# EAGLE design gpi-filter (EAGLE 7.1.0)
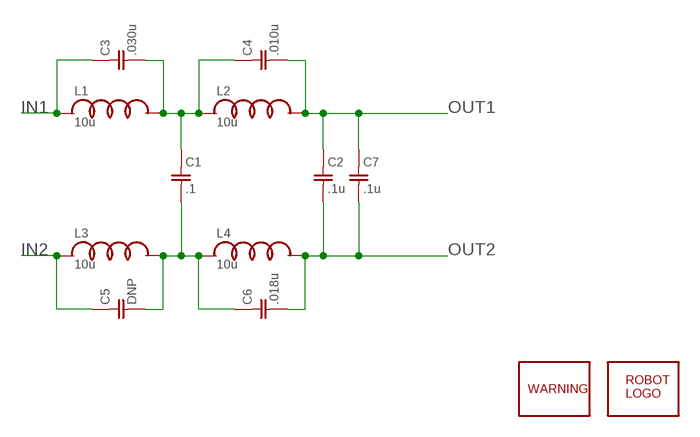
[diagram p0: schematic, sheet 1]

## Parts
C1  .1  C1210  [SMD1210]
C2  .1u  C1210  [SMD1210]
C3  .030u  C1210  [SMD1210]
C4  .010u  C1210  [SMD1210]
C5  DNP  C1210  [SMD1210]
C6  .018u  C1210  [SMD1210]
C7  .1u  C1210  [SMD1210]
L1  10u  LXAL10  [XAL10]
L2  10u  LXAL10  [XAL10]
L3  10u  LXAL10  [XAL10]
L4  10u  LXAL10  [XAL10]
U$1  ROBOTMAN-LOGO  [ROBOTMAN-LOGO]
U$2  SYMBOL-WARNING  [SYMBOL-WARNING]

## Nets
IN1: C3.1 L1.P$1
IN2: C5.1 L3.P$1
N$1: C1.1 C3.2 C4.1 L1.P$2 L2.P$1
N$4: C1.2 C5.2 C6.1 L3.P$2 L4.P$1
OUT1: C2.1 C4.2 C7.1 L2.P$2
OUT2: C2.2 C6.2 C7.2 L4.P$2

## Library data of the parts
C1-C7 = jaw:C
L1-L4 = jaw:L
U$1 = jaw:ROBOTMAN-LOGO
U$2 = jaw:SYMBOL-WARNING

## Board
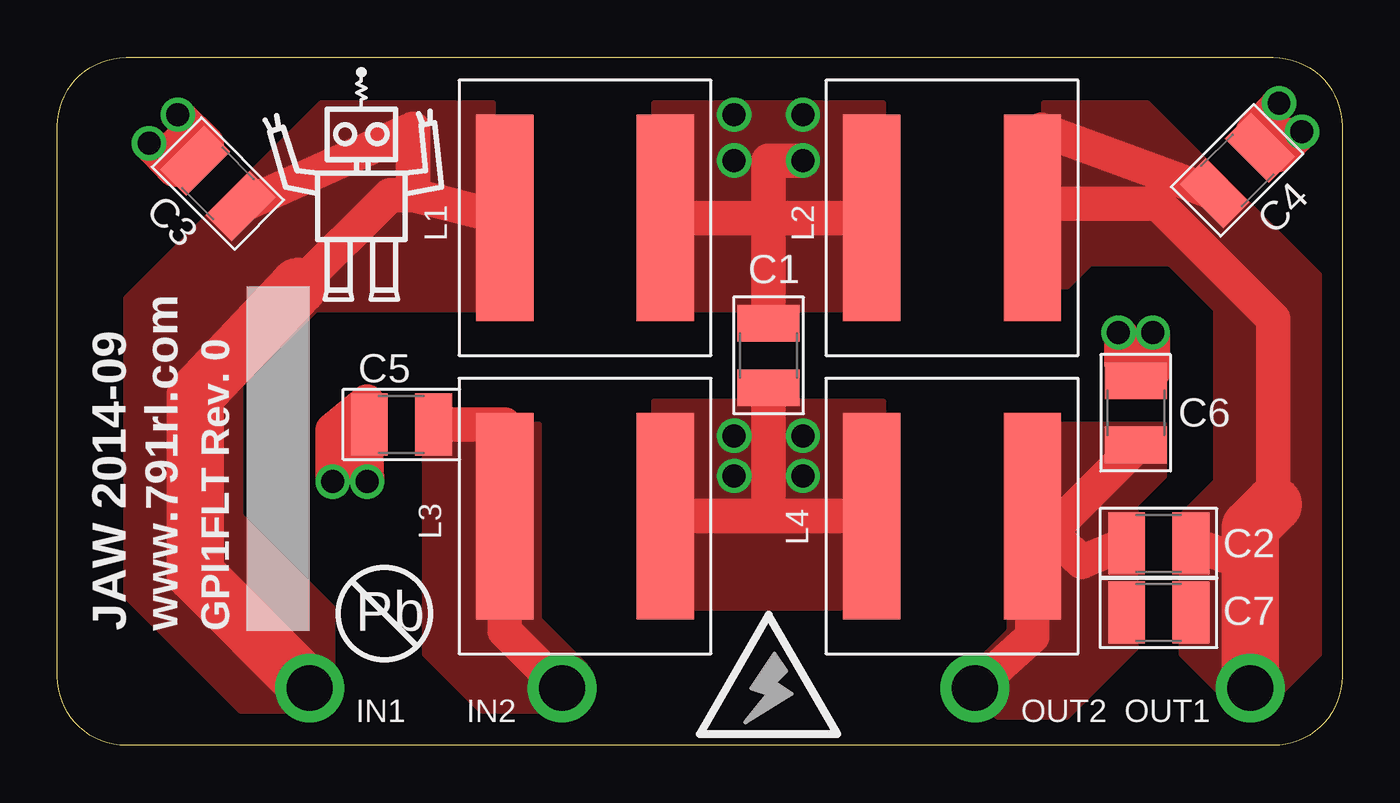
[diagram p1: board, top side]
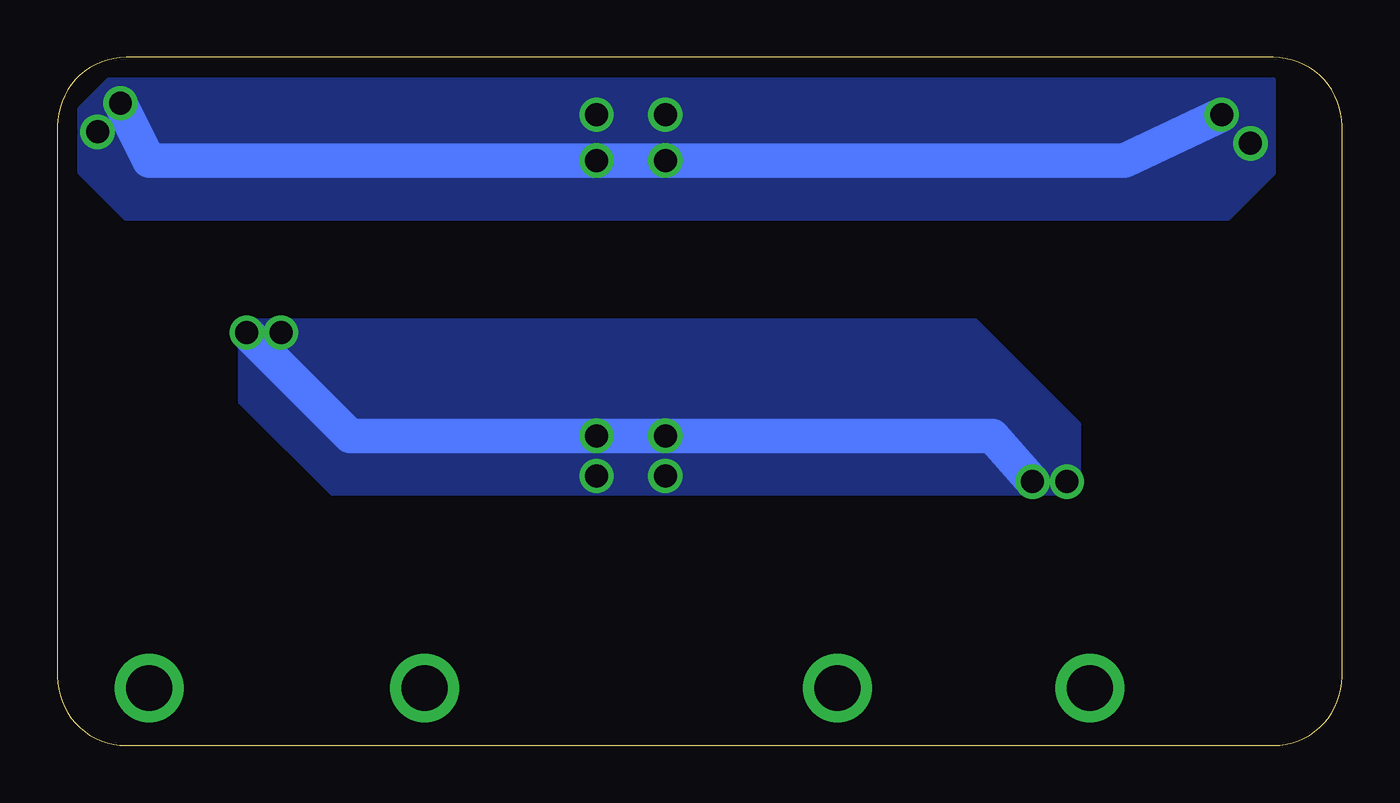
[diagram p2: board, bottom side, seen from below]

Size 56 x 30 mm. Coordinates in mm from the lower left corner, seen from the top.
Outline: 3,30 53,30 arc-90 56,27 56,3 arc-90 53,0 3,0 arc-90 0,3 0,27 arc-90 3,30
Copper layers (1*16): Top 0.0356mm / dielectric 1.5011mm / Bottom 0.0356mm
Design rules "LaenPCBOrder *": minimum track width 6mil, minimum drill 13mil, track to track 6mil, track to pad 6mil, pad to pad 6mil, via to via 6mil, smd to smd 6mil, copper to edge 15mil, drill to drill 6mil, minimum pad ring 7mil, minimum via ring 7mil, stop-mask expansion 4mil, vias tented up to drill 1.5mm, thermal gap 10mil

### Footprints (pad centres in the part's own frame; a part is rotated, then mirrored left to right if it is on the bottom)
SMD1210 = smd 1.6 x 2.7: 1 -1.4,0; 2 1.4,0
XAL10 = smd 2.5 x 9: P$1 -3.5,0; P$2 3.5,0

### Placement (x,y rotation side)
C1  31,17 270 top
C2  48,8.8 180 top
C3  .027u  [SMD1210]  7,24.5 135 top
C4  .018u  [SMD1210]  51.43,25.07 225 top
C5  15,14 180 top
C6  .010u  [SMD1210]  47,14.5 270 top
C7  48,5.8 180 top
L1  23,23 0 top
L2  39,23 0 top
L3  23,10 0 top
L4  39,10 0 top
U$1  13.25,23.75 0 top
U$2  31,2.5 0 top

### Tracks (layer width: path | path; a pad name or v marks a point on that pad's centre or on a via)
IN1  (via drill 2 pad 3)
  Top 1.5: 10.5,20 14.5,24 15.5,24 | 15.5,24 L1.P$1 | C3.1 15.5,26.9 15.5,24
  Top 2.5: 10.5,20 6,15.25 6,7.5 v11,2.5
  pour Top (no thermals): 12,1.5 12,6 8,10 8,15.75 11.25,19 19,19 19,28 11.5,28 3,19.5 3,6.5 8,1.5
IN2  (via drill 2 pad 3)
  Top 1.5: v22,2.5 19.5,5 L3.P$1 19.5,14 C5.1
  pour Top (no thermals): 21,14 21,5.5 23,3.5 21,1.5 18.5,1.5 16,4 16,13 17,14
N$1  (via drill 1)
  Top 1.5: L1.P$2 31,23 | 31,23 L2.P$1 | C1.1 31,23 | v32.5,25.5 31,25.5 31,23 | v53.25,28 52.1,26.75 C4.1 53.65,26.6 52.5,26.25 53.25,25.75 v54.25,26.75 | v4,26.25 5.1,25.1 | 5.1,25.1 5.25,26.25 | 5.25,26.25 5.1,25.1 | 5.1,25.1 C3.2 6,25.98 5.25,26.25 | v5.25,27.5 6.5,26.25 5.25,26.25
  Bottom 1.5: v5.25,27.5 9.5,25.5 v32.5,25.5 52,25.5 v53.25,28
  other vias: 29.5,27.5 32.5,27.5 29.5,25.5
  pour Top (no thermals): 26,28 36,28 36,19 26,19
  pour Bottom (no thermals): 3,29 53.75,29 55,27.75 55,25 53,23 5,23 3,25
N$4  (via drill 1)
  Top 1.5: L3.P$2 29.75,10 31,10 | 31,10 L4.P$1 | v13.5,11.5 13.4,14.5 C5.2 13.6,13.85 13.5,15 12,13.75 v12,11.5 | C1.2 31,10 | v46.25,18 46.38,17.88 46.38,16.62 46.6,16.4 C6.1 | v47.75,18 47.75,16.25 47.5,16 47,16
  Bottom 1.5: v47.75,18 43.25,13.5 v32.5,13.5 15.25,13.5 v13.5,11.5
  other vias: 29.5,13.5 29.5,11.75 32.5,11.75
  pour Top (no thermals): 26,15 36,15 36,6 26,6
  pour Bottom (no thermals): 48,18.5 16,18.5 11.5,14 11.5,11.5 12,11 44,11 48,15
OUT1  (via drill 2 pad 3)
  Top 1.5: C2.1 51.9,7.9 52,9.5 | L2.P$2 42.88,23.62 | 42.88,23.62 42.9,26.85 C4.2 | 53,10.5 53,18.6 47.98,23.62 42.88,23.62
  Top 2.5: v52,2.5 52,9.5 53,10.5
  pour Top (no thermals): 43,28 47.5,28 55,20.5 55,4 53,2 51,2 49,4 49,10 50.5,11.5 50.5,19 48.5,21 45,21 44,20 43,20
OUT2  (via drill 2 pad 3)
  Top 1.5: C2.2 44.65,8 43.29,9.29 | 43.29,9.29 L4.P$2 42.5,4.75 v40,2.5 | C6.2 47.1,13.1 43.29,9.29
  pour Top (no thermals): 40,3.5 41.5,5 41.5,14 48.25,14 48.25,11.75 47,10.5 47,4.25 44,1.25 41,1.25 40,2.25

### Text on the board
tPlace: JAW 2014-09 | www.791rl.com | GPI1FLT Rev. 0 | Pb | IN2 | OUT1 | IN1 | OUT2